# Altium project lab1_samarin_usb_rs485.PrjPcb
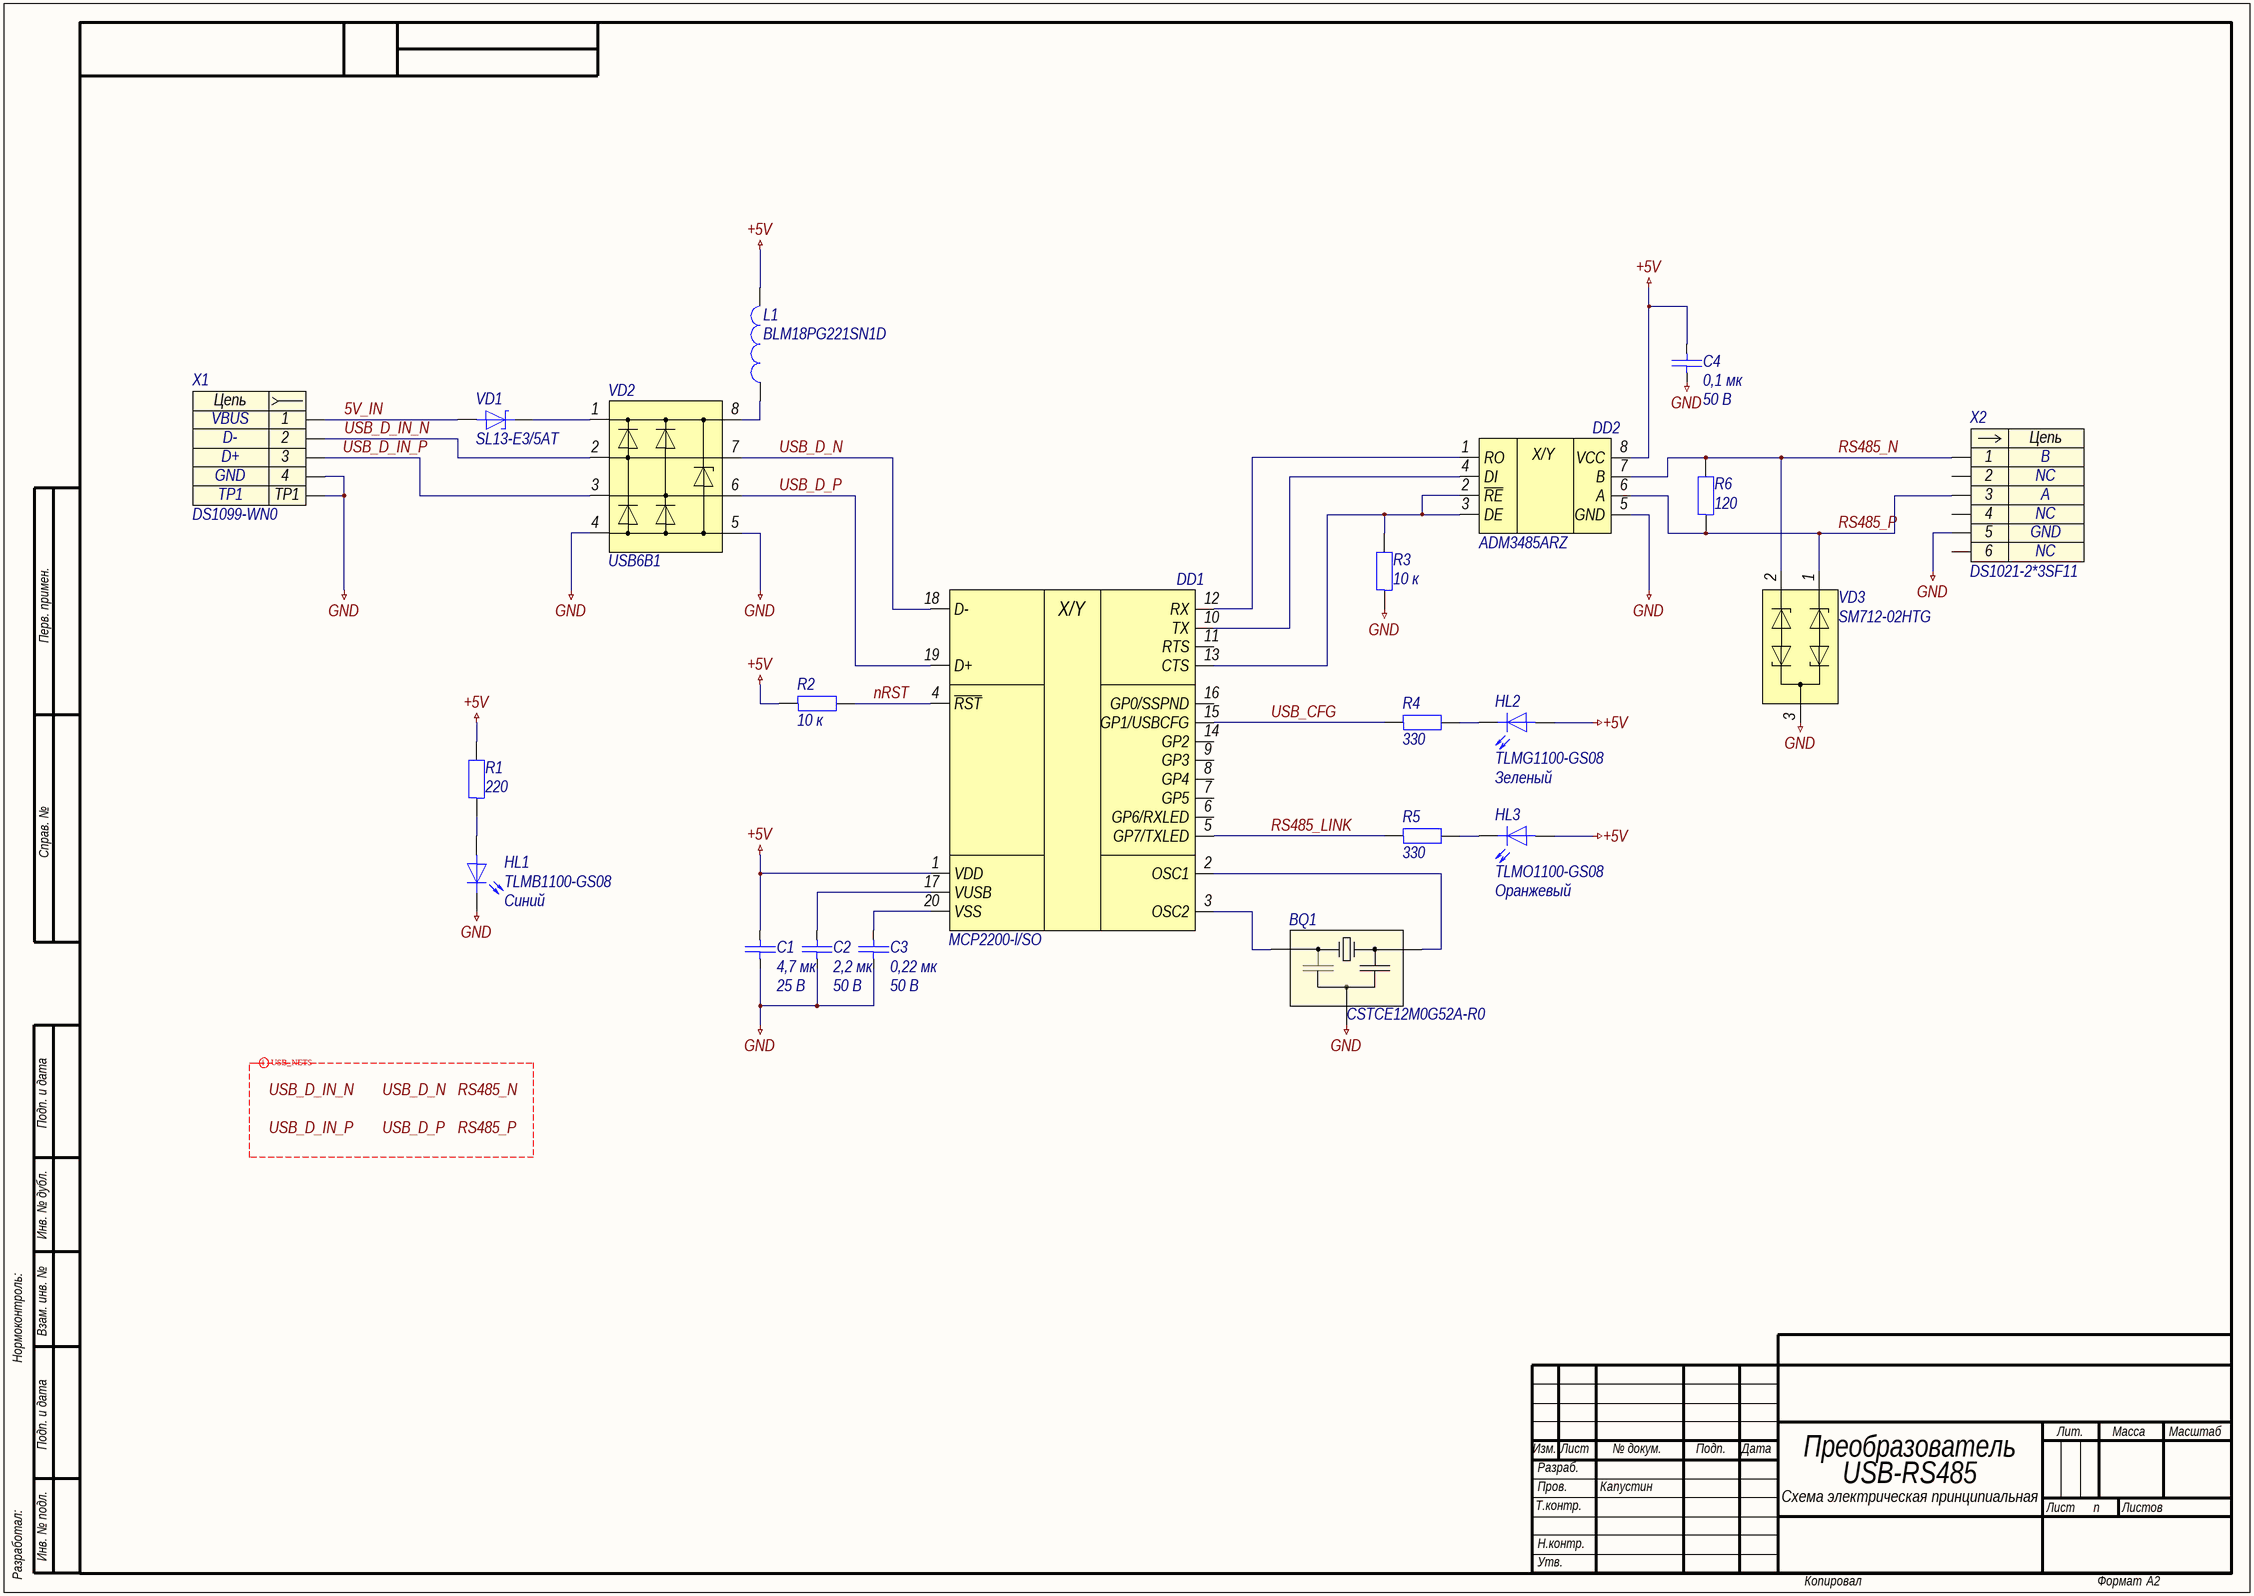
[diagram p0: lab1_samarin_usb_rs485.SchDoc]
approver: Капустин; check: Капустин; designation: СПБПУ.331506.21; developer: Самарин; document_code: Ý3; document_type: Схема электрическая принципиальная; pcb_dec_number: СПБПУ.331506.21; project: Лабораторная работа №1; title: Преобразователь USB-RS485; title_line_1: Преобразователь; title_line_2: USB-RS485
1 sheet, 22 parts. Net scope: global (net labels, ports and power ports of the same name join across sheets).
Board file: lab1_samarin_usb_rs485.PcbDoc

## Sheet lab1_samarin_usb_rs485.SchDoc: Преобразователь USB-RS485
size 594 x 420 mm; ApprovedBy: Капустин; CheckedBy: Капустин; DrawnBy: Самарин; DocumentNumber: СПБПУ.331506.21Ý3; SheetNumber: n; DocumentCode: Ý3; ImagePath: СПБПУ.331506.21

### Parts
BQ1  CSTCE12M0G52A-R0  [CSTCE-3-320X130X70]
C1  4,7 мк  Напряжение: 25 В  [C0603]
C2  2,2 мк  Напряжение: 50 В  [C0603]
C3  0,22 мк  Напряжение: 50 В  [C0603]
C4  0,1 мк  Напряжение: 50 В  [C0603]
DD1  MCP2200-l/SO  [SOIC-20]
DD2  ADM3485ARZ  [SOIC-8]
HL1  TLMB1100-GS08  Colour: Синий  [HL0603]
HL2  TLMG1100-GS08  Colour: Зеленый  [HL0603]
HL3  TLMO1100-GS08  Colour: Оранжевый  [HL0603]
L1  BLM18PG221SN1D  [BLM-2-0603]
R1  220  [R0603]
R2  10 к  [R0603]
R3  10 к  [R0603]
R4  330  [R0603]
R5  330  [R0603]
R6  120  [R0603]
VD1  SL13-E3/5AT  [DO-214AC]
VD2  USB6B1  [SOIC-8]
VD3  SM712-02HTG  [SOT-23-3]
X1  DS1099-WN0  [DS1099-WN0]
X2  DS1021-2*3SF11  [DS1021-2X3SF11]

### Nets
+5V: C1.1 C4.1 DD1.1(VDD) DD2.8(VCC) HL2.2 HL3.2 L1.2 R1.2 R2.1
GND: BQ1.2 C1.2 C2.2 C3.2 C4.2 DD2.5(GND) HL1.1 R3.1 VD2.4 VD2.5 VD3.3 X1.4 X1.TP1 X2.5
5V_IN: VD1.2 X1.1
nRST: DD1.4(~{RST}) R2.2
RS485_LINK: DD1.5(GP7/TXLED) R5.1
RS485_N: DD2.7(B) R6.2 VD3.2 X2.1
RS485_P: DD2.6(A) R6.1 VD3.1 X2.3
USB_CFG: DD1.15(GP1/USBCFG) R4.1
USB_D_IN_N: VD2.2 X1.2
USB_D_IN_P: VD2.3 X1.3
USB_D_N: DD1.18(D-) VD2.7
USB_D_P: DD1.19(D+) VD2.6
NetBQ1_1: BQ1.1 DD1.2(OSC1)
NetBQ1_3: BQ1.3 DD1.3(OSC2)
NetC2_1: C2.1 DD1.17(VUSB)
NetC3_1: C3.1 DD1.20(VSS)
NetDD1_10: DD1.10(TX) DD2.4(DI)
NetDD1_12: DD1.12(RX) DD2.1(RO)
NetDD1_13: DD1.13(CTS) DD2.2(~{RE}) DD2.3(DE) R3.2
NetHL1_2: HL1.2 R1.1
NetHL2_1: HL2.1 R4.2
NetHL3_1: HL3.1 R5.2
NetL1_1: L1.1 VD2.8
NetVD1_1: VD1.1 VD2.1

Not connected (* = marked no-connect by the designer): DD1 6(GP6/RXLED) 7(GP5) 8(GP4) 9(GP3) 11(RTS) 14(GP2) 16(GP0/SSPND); X2 2 4 6

### Layout directives
differential pair; differential pair class USB_SIGNALS; rule Differential Pairs Routing [Pref Gap = 0.254mm    Min Gap  = 0.15mm    Max Gap  = 0.254mmPref Width = 0.381mm    Min Width  = 0.155mm    Max Width  = 0.381mm]: RS485_N, RS485_P, USB_D_IN_N, USB_D_IN_P, USB_D_N, USB_D_P

### Notes on the sheet
- Labels drawn without touching a wire or pin: RS485_N, RS485_P, USB_D_IN_N, USB_D_IN_P, USB_D_N, USB_D_P
- Перв. примен.
- Справ. №
- Подп. и дата
- Инв. № дубл.
- Нормоконтроль:
- Взам. инв. №
- Изм.
- Лист
- № докум.
- Подп.
- Дата
- Лит.
- Масса
- Масштаб
- Т.контр.
- Пров.
- Разраб.
- Листов
- Разработал:
- Инв. № подл.
- Н.контр.
- Утв.
- Копировал
- Формат
- А2
- (in symbol dd0008) X/Y
- (in symbol dd0011) X/Y
- (in symbol x0003) Цепь
- (in symbol x0005) Цепь

### Library data of the parts
BQ1 = bq0001: =Описание; ID: bq0001; Фамилия: Самарин; Описание: Кварцевый резонатор 12 МГц; Производитель: Murata Manufacturing Co., Ltd.; Частота: 12 МГц; Корпус: 3,20 x 1,30 x 0,70; Наименование: CSTCE12M0G52A-R0; HelpURL: https://www.murata.com/en-us/products/productdetail?partno=CSTCE12M0G52A-R0
C1 = c0111: =Описание; ID: c0111; Фамилия: Ларионов; Описание: Конденсатор керамический чип 0603 4,7 мкФ 25 В ±10 %; Наименование: CC0603KRX5R8BB475; Производитель: YAGEO Corp.; Отклонение: ±10 %; Рабочие температуры: от –55 °С до +85 °С; Температурный коэффициент емкости: X5R; Корпус: 0603; Номинал: 4,7 мк; Номинальное напряжение: 25 В; HelpURL: https://www.yageo.com/upload/media/product/productsearch/datasheet/mlcc/UPY-GPHC_X5R_4V-to-50V_26.pdf
C2 = c0102: =Описание; ID: c0102; Фамилия: Самарин; Описание: Конденсатор керамический чип 0603 2,2 мкФ 50 В ±10 %; Наименование: CC0603KRX5R9BB225; Производитель: YAGEO Corp.; Отклонение: ±10 %; Рабочие температуры: от –55 °С до +85 °С; Температурный коэффициент емкости: X5R; Корпус: 0603; Номинал: 2,2 мк; Номинальное напряжение: 50 В; HelpURL: https://www.yageo.com/upload/media/product/productsearch/datasheet/mlcc/UPY-GPHC_X5R_4V-to-50V_26.pdf
C3 = c0072: =Описание; ID: c0072; Фамилия: Самарин; Описание: Конденсатор керамический чип 0603 220 нФ 50 В ±5 %; Наименование: CC0603JRX7R9BB224; Производитель: YAGEO Corp.; Отклонение: ±5 %; Рабочие температуры: от –55 °С до +125 °С; Температурный коэффициент емкости: X7R; Корпус: 0603; Номинал: 0,22 мк; Номинальное напряжение: 50 В; HelpURL: https://www.yageo.com/upload/media/product/productsearch/datasheet/mlcc/UPY-GPHC_X7R_6.3V-to-50V_20.pdf
C4 = c0060: =Описание; ID: c0060; Фамилия: Ларионов; Описание: Конденсатор керамический чип 0603 100 нФ 50 В ±5 %; Наименование: CC0603JRX7R9BB104; Производитель: YAGEO Corp.; Отклонение: ±5 %; Рабочие температуры: от –55 °С до +125 °С; Температурный коэффициент емкости: X7R; Корпус: 0603; Номинал: 0,1 мк; Номинальное напряжение: 50 В; HelpURL: https://www.yageo.com/upload/media/product/productsearch/datasheet/mlcc/UPY-GPHC_X7R_6.3V-to-50V_20.pdf
DD1 = dd0008: =Описание; ID: dd0008; Фамилия: Самарин; Описание: Преобразователь USB-UART; Производитель: Microchip Technology Inc.; Наименование: MCP2200-l/SO; Корпус: SOIC-20; HelpURL: https://www.microchip.com/wwwproducts/en/mcp2200
DD2 = dd0011: =Описание; ID: dd0011; Фамилия: Самарин; Описание: Приемопередатчик RS-485/RS-422; Производитель: Analog Devices, Inc.; Наименование: ADM3485ARZ; Корпус: SOIC-8; HelpURL: https://www.analog.com/ru/products/adm3485.html
HL1 = hl0006: =Описание; ID: hl0006; Фамилия: Ларионов; Описание: Светодиод чип 0603 синий; Производитель: Vishay Intertechnology, Inc.; Номинальная сила света: 5 мкд; Номинальная длина волны: 466 нм; Номинальный прямой ток: 30 мА; Номинальное падение напряжения: 3,9 В; Рассеиваемая мощность: 90 мВт; Рабочие температуры: от –40 °С до +100 °С; Корпус: 0603; Примечание: Not for new design; Наименование: TLMB1100-GS08; Цвет: Синий; HelpURL: https://www.vishay.com/leds/list/product-83173/
HL2 = hl0005: =Описание; ID: hl0005; Фамилия: Ларионов; Описание: Светодиод чип 0603 зеленый; Производитель: Vishay Intertechnology, Inc.; Номинальная сила света: 35 мкд; Номинальная длина волны: 570 нм; Номинальный прямой ток: 30 мА; Номинальное падение напряжения: 2,1 В; Рассеиваемая мощность: 90 мВт; Рабочие температуры: от –40 °С до +100 °С; Корпус: 0603; Наименование: TLMG1100-GS08; Цвет: Зеленый; HelpURL: https://www.vishay.com/leds/list/product-83173/
HL3 = hl0004: =Описание; ID: hl0004; Фамилия: Ларионов; Описание: Светодиод чип 0603 оранжевый; Производитель: Vishay Intertechnology, Inc.; Номинальная сила света: 80 мкд; Номинальная длина волны: 606 нм; Номинальный прямой ток: 30 мА; Номинальное падение напряжения: 2,1 В; Рассеиваемая мощность: 90 мВт; Рабочие температуры: от –40 °С до +100 °С; Корпус: 0603; Наименование: TLMO1100-GS08; Цвет: Оранжевый; HelpURL: https://www.vishay.com/leds/list/product-83173/
L1 = l0002: =Описание; ID: l0002; Фамилия: Самарин; Описание: Ферритовая бусина 220 Ом ±25 %; Производитель: Murata Manufacturing Co., Ltd.; Сопротивление, 100 МГц: 220 Ом; Отклонение, 100 МГц: ±25 %; Сопротивление при постоянном токе: 0,1 Ом; Рабочие температуры: от –55 °С до +125 °С; Корпус: 0603; Наименование: BLM18PG221SN1D; HelpURL: https://www.murata.com/en-global/products/productdetail?partno=BLM18PG221SN1%23
R1 = r0007: =Описание; ID: r0007; Фамилия: Ларионов; Описание: Резистор чип 0603 220 Ом ±1 % 0,1 Вт; Наименование: RC0603FR-07220RL; Производитель: Yageo; Отклонение: ±1 %; Номинальное напряжение: 75 В; Рабочие температуры: от -55 °С до +155 °С; Номинальный ток: 1 А; Корпус: 0603; Номинал: 220; HelpURL: https://www.yageo.com/upload/media/product/productsearch/datasheet/rchip/PYu-RC_Group_51_RoHS_L_11.pdf
R2 = r0009: =Описание; ID: r0009; Фамилия: Самарин; Описание: Резистор чип 0603 10 кОм ±1 % 0,1 Вт; Наименование: RC0603FR-0710KL; Производитель: Yageo; Отклонение: ±1 %; Номинальное напряжение: 75 В; Рабочие температуры: от -55 °С до +155 °С; Номинальный ток: 1 А; Корпус: 0603; Номинал: 10 к; HelpURL: https://www.yageo.com/upload/media/product/productsearch/datasheet/rchip/PYu-RC_Group_51_RoHS_L_11.pdf
R3 = r0012: =Описание; ID: r0012; Фамилия: Самарин; Описание: Резистор чип 0603 10 кОм ±1 % 0,1 Вт; Наименование: RC0603FR-0710KL; Производитель: Yageo; Отклонение: ±1 %; Номинальное напряжение: 75 В; Рабочие температуры: от -55 °С до +155 °С; Номинальный ток: 1 А; Корпус: 0603; Номинал: 10 к; HelpURL: https://www.yageo.com/upload/media/product/productsearch/datasheet/rchip/PYu-RC_Group_51_RoHS_L_11.pdf
R4 R5 = r0008: =Описание; ID: r0008; Фамилия: Ларионов; Описание: Резистор чип 0603 330 Ом ±1 % 0,1 Вт; Наименование: RC0603FR-07330RL; Производитель: Yageo; Отклонение: ±1 %; Номинальное напряжение: 75 В; Рабочие температуры: от -55 °С до +155 °С; Номинальный ток: 1 А; Корпус: 0603; Номинал: 330; HelpURL: https://www.yageo.com/upload/media/product/productsearch/datasheet/rchip/PYu-RC_Group_51_RoHS_L_11.pdf
R6 = r0006: =Описание; ID: r0006; Фамилия: Самарин; Описание: Резистор чип 0603 120 Ом ±1 % 0,1 Вт; Наименование: RC0603FR‍‐07120RL; Производитель: Yageo; Отклонение: ±1 %; Номинальное напряжение: 75 В; Рабочие температуры: от -55 °С до +155 °С; Номинальный ток: 1 А; Корпус: 0603; Номинал: 120; HelpURL: https://www.yageo.com/upload/media/product/productsearch/datasheet/rchip/PYu-RC_Group_51_RoHS_L_11.pdf
VD1 = vd0003: =Описание; ID: vd0003; Фамилия: Ларионов; Описание: Диод Шоттки 30 В 1,5 А; Производитель: Vishay Intertechnology, Inc.; Максимальное прямое напряжение: 0,445 В; Максимальное обратное напряжение: 30 В; Максимальный прямой ток: 1,5 А; Рабочие температуры: от –55 °С до +125 °С; Наименование: SL13-E3/5AT; Корпус: DO-214AC; HelpURL: https://www.vishay.com/product?docid=88740
VD2 = vd0010: =Описание; ID: vd0010; Фамилия: Ларионов; Описание: Диодная сборка для подавления помех, от 6 В; Производитель: STMicroelectronics; Наименование: USB6B1; Корпус: SOIC-8; HelpURL: https://www.st.com/content/st_com/en/products/protection-devices/esd-protection/usb-port-protection/usb6b1.html
VD3 = vd0002: =Описание; ID: vd0002; Фамилия: Самарин; Описание: Диодная сборка для подавления помех, –7/12 В; Производитель: Littelfuse, Inc.; Наименование: SM712-02HTG; Корпус: SOT-23-3; HelpURL: https://www.littelfuse.com/products/tvs-diode-arrays/general-purpose-esd-protection/sm712.aspx
X1 = x0005: =Описание; Contact_1: VBUS; Contact_2: D-; Contact_3: D+; Contact_4: GND; ID: x0005; Фамилия: Самарин; Описание: USB Type B гнездо; Производитель: Connfly Electronic Co. LTD; Наименование: DS1099-WN0; HelpURL: http://www.connfly.com/productshow.aspx?id=407
X2 = x0003: =Описание; Contact_1: B; Contact_2: NC; Contact_3: A; Contact_5: GND; ID: x0003; Фамилия: Самарин; Описание: PLS 3x2 pin 2,54 мм вилка прямой; Производитель: Connfly Electronic Co. LTD; Contact_4: NC; Contact_6: NC; Наименование: DS1021-2*3SF11; HelpURL: http://www.connfly.com/productshow.aspx?id=118